# Altium project pizerousbhub.PrjPcb
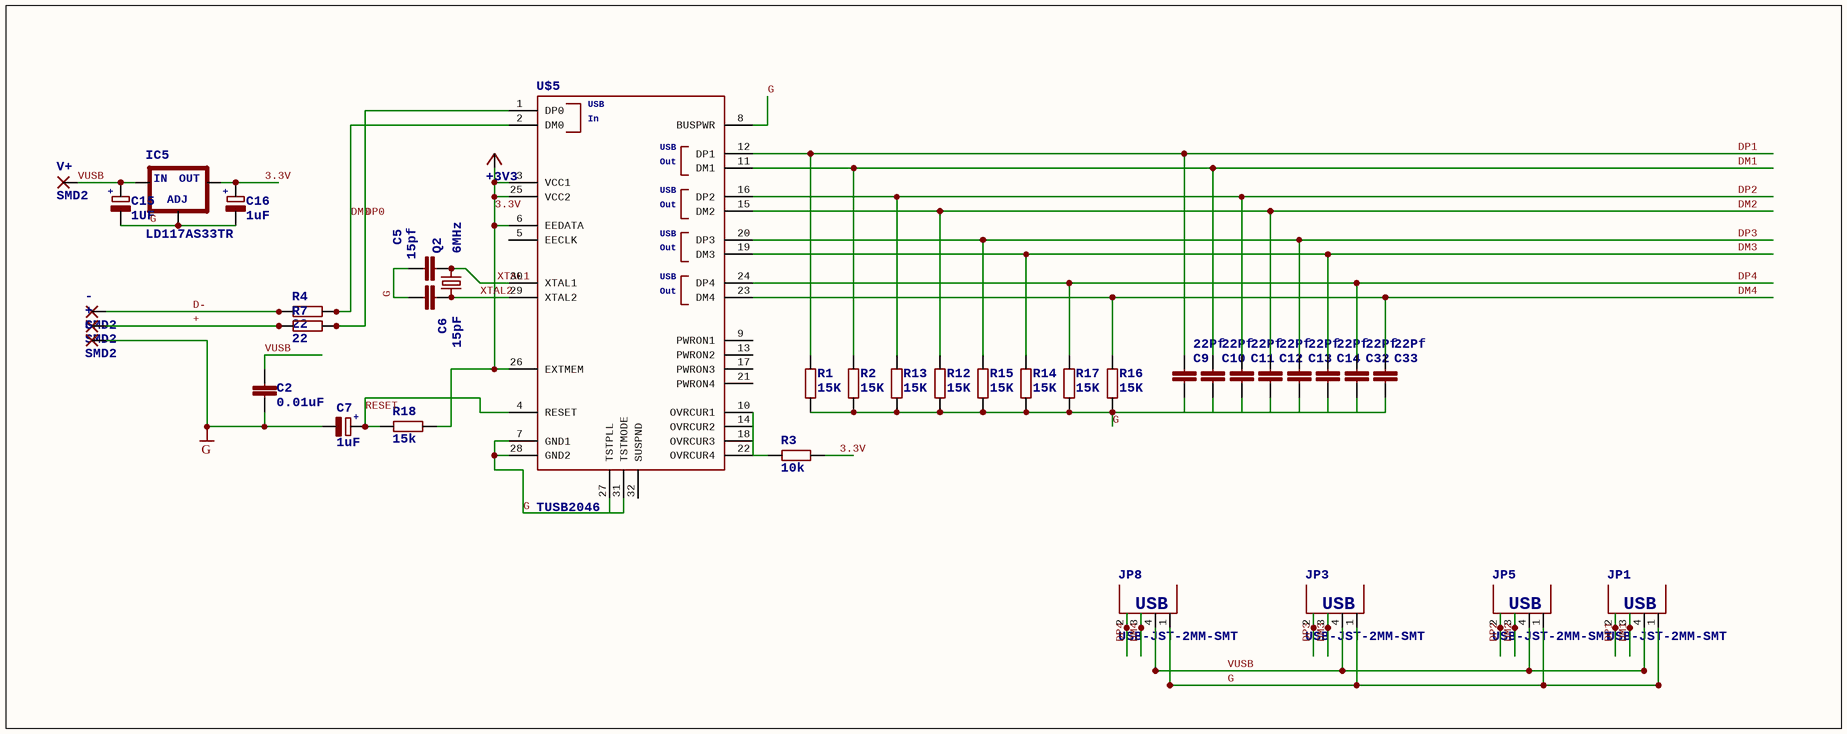
[diagram p0: pizerousbhub.SchDoc]
1 sheet, 38 parts. Net scope: global (net labels, ports and power ports of the same name join across sheets).
Board file: pizerousbhub.PcbDoc

## Sheet pizerousbhub.SchDoc
size 324 x 127 mm

### Parts
+  SMD2  [SMD1,27-2,54]
+3V1  +3V3
-  SMD2  [SMD1,27-2,54]
C2  0.01uF  [C0603]
C5  15pf  [C0603]
C6  15pF  [C0603]
C7  1uF  [A/3216-18W]
C9  22Pf  [C0603]
C10  22Pf  [C0603]
C11  22Pf  [C0603]
C12  22Pf  [C0603]
C13  22Pf  [C0603]
C14  22Pf  [C0603]
C15  1UF  [A/3216-18W]
C16  1uF  [C/6032-28R]
C32  22Pf  [C0603]
C33  22Pf  [C0603]
G  SMD2  [SMD1,27-2,54]
IC5  LD117AS33TR  [SOT223]
JP1  USB-JST-2MM-SMT  [S4B-PH]
JP3  USB-JST-2MM-SMT  [S4B-PH]
JP5  USB-JST-2MM-SMT  [S4B-PH]
JP8  USB-JST-2MM-SMT  [S4B-PH]
Q2  6MHz  [CTS406]
R1  15K  [R0603]
R2  15K  [R0603]
R3  10k  [R0603]
R4  22  [R0603]
R7  22  [R0603]
R12  15K  [R0603]
R13  15K  [R0603]
R14  15K  [R0603]
R15  15K  [R0603]
R16  15K  [R0603]
R17  15K  [R0603]
R18  15k  [R0603]
U$5  TUSB2046  [LQFP-32]
V+  SMD2  [SMD1,27-2,54]

### Nets
G: C2.2 C5.1 C6.2 C7.- C9.2 C10.2 C11.2 C12.2 C13.2 C14.2 C15.- C16.- C32.2 C33.2 G.1(P) IC5.1(ADJ) JP1.1(GND) JP3.1(GND) JP5.1(GND) JP8.1(GND) R1.2 R2.2 R12.2 R13.2 R14.2 R15.2 R16.2 R17.2 U$5.7(GND1) U$5.8(BUSPWR) U$5.27(TSTPLL) U$5.28(GND2) U$5.31(TSTMODE)
3.3V: +3V1.?1(+3V3) C16.+ IC5.4(OUT) R3.2 R18.1 U$5.3(VCC1) U$5.6(EEDATA) U$5.25(VCC2) U$5.26(EXTMEM)
+: +.1(P) R7.2
D-: -.1(P) R4.2
DM0: R4.1 U$5.2(DM0)
DM1: C10.1 JP1.3(D-) R2.1 U$5.11(DM1)
DM2: C12.1 JP5.3(D-) R12.1 U$5.15(DM2)
DM3: C14.1 JP3.3(D-) R14.1 U$5.19(DM3)
DM4: C33.1 JP8.3(D-) R16.1 U$5.23(DM4)
DP0: R7.1 U$5.1(DP0)
DP1: C9.1 JP1.2(D+) R1.1 U$5.12(DP1)
DP2: C11.1 JP5.2(D+) R13.1 U$5.16(DP2)
DP3: C13.1 JP3.2(D+) R15.1 U$5.20(DP3)
DP4: C32.1 JP8.2(D+) R17.1 U$5.24(DP4)
RESET: C7.+ R18.2 U$5.4(RESET)
VUSB: C2.1 C15.+ IC5.3(IN) JP1.4(VBUS) JP3.4(VBUS) JP5.4(VBUS) JP8.4(VBUS) V+.1(P)
XTAL1: C5.2 Q2.3 U$5.30(XTAL1)
XTAL2: C6.1 Q2.1 U$5.29(XTAL2)
NetR3_1: R3.1 U$5.10(OVRCUR1) U$5.14(OVRCUR2) U$5.18(OVRCUR3) U$5.22(OVRCUR4)

Not connected (* = marked no-connect by the designer): U$5 5(EECLK) 9(PWRON1) 13(PWRON2) 17(PWRON3) 21(PWRON4) 32(SUSPND)

### Library data of the parts
+ - G V+ = SMD2: SMD PAD
+3V1 = +3V3: SUPPLY SYMBOL
C2 C5 C6 C9-C14 C32 C33 = C-EUC0603: CAPACITOR, European symbol
C7 C15 = CPOL-EUA/3216-18W: POLARIZED CAPACITOR, European symbol; +: +
C16 = CPOL-EUC/6032-28R: POLARIZED CAPACITOR, European symbol; +: +
IC5 = LD117A?*S: Low drop fixed and adjustable positive voltage regulators 1 A   Source: http://www.st.com/stonline/products/literature/ds/7194/ld1117axx.pdf; ADJ: ADJ; IN: IN; OUT: OUT
JP1 JP3 JP5 JP8 = USB-JST-2MM-SMT: USB Connectors   USB-B-PTH is fully proven SKU : PRT-00139/CONN-08278    USB-miniB is fully proven SKU : PRT-00587    USB-A-PCB is untested.    USB-A-H is throughly reviewed, but untested. Spark Fun Electronics SKU : PRT-00437    USB-B-SMT is throughly reviewed, but untested. Needs silkscreen touching up.    USB-A-S has not been used/tested    USB-MB-H has not been used/tested    USB-MICROB has been used. CONN-09505; PROD_ID: CONN-08193; USB: USB
Q2 = CRYSTALCTS406: CRYSTAL
R1-R4 R7 R12-R18 = R-EU_R0603: RESISTOR, European symbol
U$5 = TUSB2046: ORDERCODE: 1470507; SUPPLIER: farnell; USB: USB; In: In; Out: Out